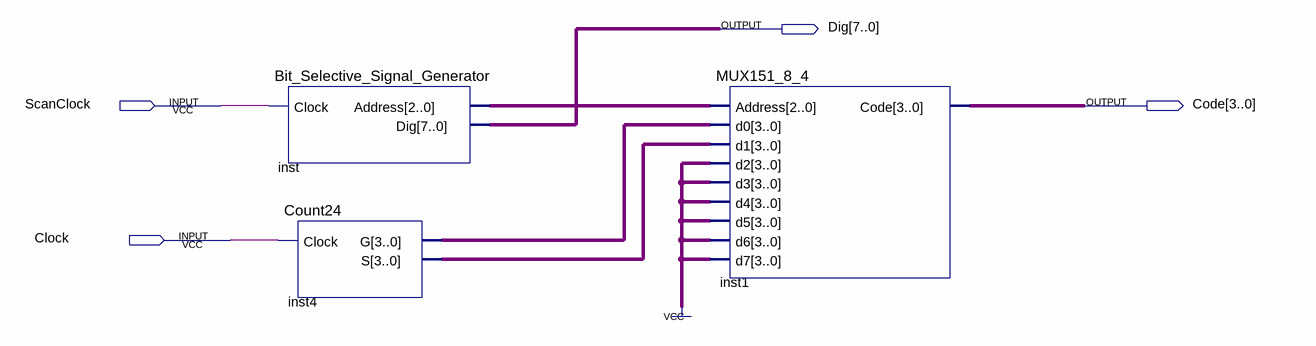
[diagram p0: schematic sheet]
// Quartus schematic Scan_Module.bdf as structural Verilog: 3 symbols, 4 pins
module Scan_Module (
  input  ScanClock,
  input  Clock,
  output [7:0] Dig,
  output [3:0] Code
);

  wire [2:0] inst_address;
  wire [3:0] inst4_g, inst4_s;

  Bit_Selective_Signal_Generator inst (.Clock(ScanClock), .Address(inst_address), .Dig(Dig));
  Count24 inst4 (.Clock(Clock), .G(inst4_g), .S(inst4_s));
  MUX151_8_4 inst1 (
    .Address(inst_address), .d0(inst4_g), .d1(inst4_s), .d2(4'b1111), .d3(4'b1111), .d4(4'b1111),
    .d5(4'b1111), .d6(4'b1111), .d7(4'b1111), .Code(Code));
endmodule
